# Altium schematic sheet OutputConnectors.SchDoc: Output Connectors
size Letter; Engineer: Brandt Buchda & Patrick Nowakowski; SheetNumber: 3; SheetTotal: 4
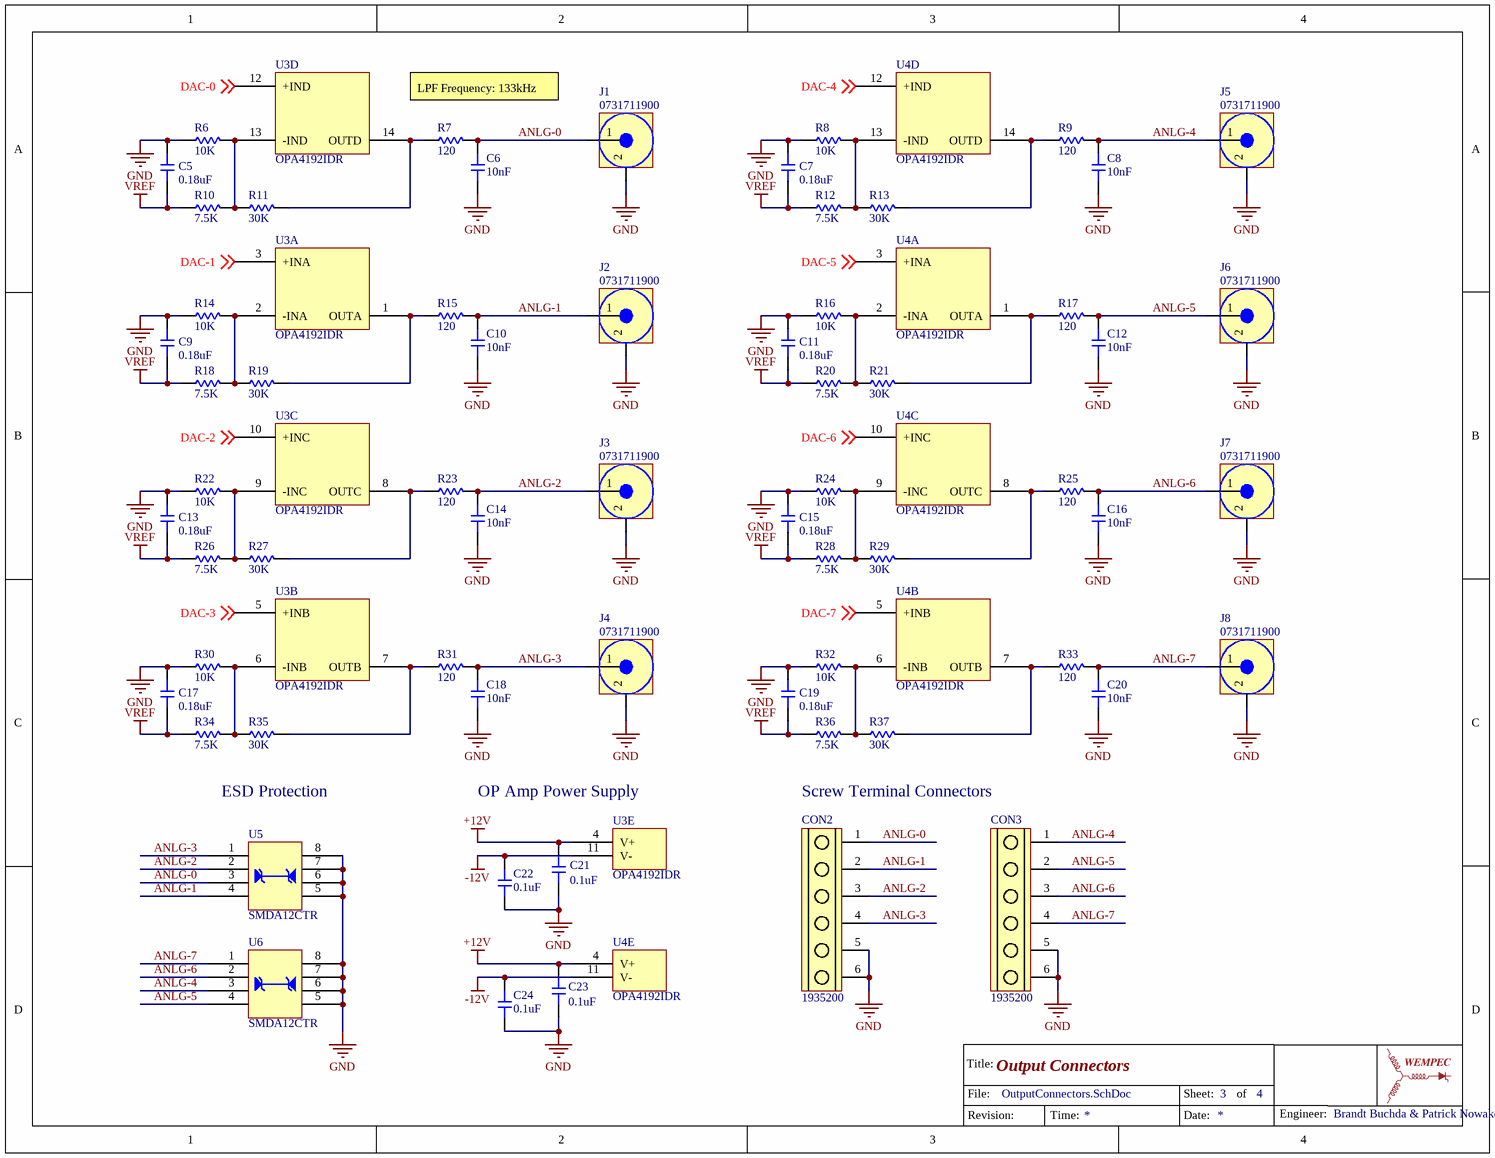
[diagram p0: OutputConnectors.SchDoc]

## Parts
C5  value 0.18uF  [0603-CAP]  (hidden comment: CC0603KRX7R7BB184)
C6  value 10nF  [0603-CAP]  (hidden comment: CC0603KRX7R9BB103)
C7  value 0.18uF  [0603-CAP]  (hidden comment: CC0603KRX7R7BB184)
C8  value 10nF  [0603-CAP]  (hidden comment: CC0603KRX7R9BB103)
C9  value 0.18uF  [0603-CAP]  (hidden comment: CC0603KRX7R7BB184)
C10  value 10nF  [0603-CAP]  (hidden comment: CC0603KRX7R9BB103)
C11  value 0.18uF  [0603-CAP]  (hidden comment: CC0603KRX7R7BB184)
C12  value 10nF  [0603-CAP]  (hidden comment: CC0603KRX7R9BB103)
C13  value 0.18uF  [0603-CAP]  (hidden comment: CC0603KRX7R7BB184)
C14  value 10nF  [0603-CAP]  (hidden comment: CC0603KRX7R9BB103)
C15  value 0.18uF  [0603-CAP]  (hidden comment: CC0603KRX7R7BB184)
C16  value 10nF  [0603-CAP]  (hidden comment: CC0603KRX7R9BB103)
C17  value 0.18uF  [0603-CAP]  (hidden comment: CC0603KRX7R7BB184)
C18  value 10nF  [0603-CAP]  (hidden comment: CC0603KRX7R9BB103)
C19  value 0.18uF  [0603-CAP]  (hidden comment: CC0603KRX7R7BB184)
C20  value 10nF  [0603-CAP]  (hidden comment: CC0603KRX7R9BB103)
C21  value 0.1uF  [0603-CAP]  (hidden comment: CC0603KRX7R8BB104)
C22  value 0.1uF  [0603-CAP]  (hidden comment: CC0603KRX7R8BB104)
C23  value 0.1uF  [0603-CAP]  (hidden comment: CC0603KRX7R8BB104)
C24  value 0.1uF  [0603-CAP]  (hidden comment: CC0603KRX7R8BB104)
CON2  1935200  [1935200]
CON3  1935200  [1935200]
J1  0731711900  [0731711900]
J2  0731711900  [0731711900]
J3  0731711900  [0731711900]
J4  0731711900  [0731711900]
J5  0731711900  [0731711900]
J6  0731711900  [0731711900]
J7  0731711900  [0731711900]
J8  0731711900  [0731711900]
R6  value 10K  [0603-RES]  (hidden comment: ERJ-PB3B1002V)
R7  value 120  [0603-RES]  (hidden comment: RC0603FR-07120RL)
R8  value 10K  [0603-RES]  (hidden comment: ERJ-PB3B1002V)
R9  value 120  [0603-RES]  (hidden comment: RC0603FR-07120RL)
R10  value 7.5K  [0603-RES]  (hidden comment: ERJ-PB3B7501V)
R11  value 30K  [0603-RES]  (hidden comment: ERJ-PB3B3002V)
R12  value 7.5K  [0603-RES]  (hidden comment: ERJ-PB3B7501V)
R13  value 30K  [0603-RES]  (hidden comment: ERJ-PB3B3002V)
R14  value 10K  [0603-RES]  (hidden comment: ERJ-PB3B1002V)
R15  value 120  [0603-RES]  (hidden comment: RC0603FR-07120RL)
R16  value 10K  [0603-RES]  (hidden comment: ERJ-PB3B1002V)
R17  value 120  [0603-RES]  (hidden comment: RC0603FR-07120RL)
R18  value 7.5K  [0603-RES]  (hidden comment: ERJ-PB3B7501V)
R19  value 30K  [0603-RES]  (hidden comment: ERJ-PB3B3002V)
R20  value 7.5K  [0603-RES]  (hidden comment: ERJ-PB3B7501V)
R21  value 30K  [0603-RES]  (hidden comment: ERJ-PB3B3002V)
R22  value 10K  [0603-RES]  (hidden comment: ERJ-PB3B1002V)
R23  value 120  [0603-RES]  (hidden comment: RC0603FR-07120RL)
R24  value 10K  [0603-RES]  (hidden comment: ERJ-PB3B1002V)
R25  value 120  [0603-RES]  (hidden comment: RC0603FR-07120RL)
R26  value 7.5K  [0603-RES]  (hidden comment: ERJ-PB3B7501V)
R27  value 30K  [0603-RES]  (hidden comment: ERJ-PB3B3002V)
R28  value 7.5K  [0603-RES]  (hidden comment: ERJ-PB3B7501V)
R29  value 30K  [0603-RES]  (hidden comment: ERJ-PB3B3002V)
R30  value 10K  [0603-RES]  (hidden comment: ERJ-PB3B1002V)
R31  value 120  [0603-RES]  (hidden comment: RC0603FR-07120RL)
R32  value 10K  [0603-RES]  (hidden comment: ERJ-PB3B1002V)
R33  value 120  [0603-RES]  (hidden comment: RC0603FR-07120RL)
R34  value 7.5K  [0603-RES]  (hidden comment: ERJ-PB3B7501V)
R35  value 30K  [0603-RES]  (hidden comment: ERJ-PB3B3002V)
R36  value 7.5K  [0603-RES]  (hidden comment: ERJ-PB3B7501V)
R37  value 30K  [0603-RES]  (hidden comment: ERJ-PB3B3002V)
U3  OPA4192IDR  [SOIC127P600X175-14N]  (parts A,B,C,D,E of 5)
U4  OPA4192IDR  [SOIC127P600X175-14N]  (parts A,B,C,D,E of 5)
U5  SMDA12CTR  [SOIC127P600X175-8N-B]
U6  SMDA12CTR  [SOIC127P600X175-8N-B]

## Nets
+12V: C21.2 C23.2 U3.4(V+) U4.4(V+)
-12V: C22.2 C24.2 U3.11(V-) U4.11(V-)
GND: C5.2 C6.1 C7.2 C8.1 C9.2 C10.1 C11.2 C12.1 C13.2 C14.1 C15.2 C16.1 C17.2 C18.1 C19.2 C20.1 C21.1 C22.1 C23.1 C24.1 CON2.5 CON2.6 CON3.5 CON3.6 J1.2(GND) J2.2(GND) J3.2(GND) J4.2(GND) J5.2(GND) J6.2(GND) J7.2(GND) J8.2(GND) R6.1 R8.1 R14.1 R16.1 R22.1 R24.1 R30.1 R32.1 U5.5 U5.6 U5.7 U5.8 U6.5 U6.6 U6.7 U6.8
VREF: C5.1 C7.1 C9.1 C11.1 C13.1 C15.1 C17.1 C19.1 R10.1 R12.1 R18.1 R20.1 R26.1 R28.1 R34.1 R36.1
ANLG-0: C6.2 CON2.1 J1.1(ANLG) R7.2 U5.3
ANLG-1: C10.2 CON2.2 J2.1(ANLG) R15.2 U5.4
ANLG-2: C14.2 CON2.3 J3.1(ANLG) R23.2 U5.2
ANLG-3: C18.2 CON2.4 J4.1(ANLG) R31.2 U5.1
ANLG-4: C8.2 CON3.1 J5.1(ANLG) R9.2 U6.3
ANLG-5: C12.2 CON3.2 J6.1(ANLG) R17.2 U6.4
ANLG-6: C16.2 CON3.3 J7.1(ANLG) R25.2 U6.2
ANLG-7: C20.2 CON3.4 J8.1(ANLG) R33.2 U6.1
DAC-0: U3.12(+IND) ; off-sheet DAC-0
DAC-1: U3.3(+INA) ; off-sheet DAC-1
DAC-2: U3.10(+INC) ; off-sheet DAC-2
DAC-3: U3.5(+INB) ; off-sheet DAC-3
DAC-4: U4.12(+IND) ; off-sheet DAC-4
DAC-5: U4.3(+INA) ; off-sheet DAC-5
DAC-6: U4.10(+INC) ; off-sheet DAC-6
DAC-7: U4.5(+INB) ; off-sheet DAC-7
NetR6_2: R6.2 R10.2 R11.1 U3.13(-IND)
NetR7_1: R7.1 R11.2 U3.14(OUTD)
NetR8_2: R8.2 R12.2 R13.1 U4.13(-IND)
NetR9_1: R9.1 R13.2 U4.14(OUTD)
NetR14_2: R14.2 R18.2 R19.1 U3.2(-INA)
NetR15_1: R15.1 R19.2 U3.1(OUTA)
NetR16_2: R16.2 R20.2 R21.1 U4.2(-INA)
NetR17_1: R17.1 R21.2 U4.1(OUTA)
NetR22_2: R22.2 R26.2 R27.1 U3.9(-INC)
NetR23_1: R23.1 R27.2 U3.8(OUTC)
NetR24_2: R24.2 R28.2 R29.1 U4.9(-INC)
NetR25_1: R25.1 R29.2 U4.8(OUTC)
NetR30_2: R30.2 R34.2 R35.1 U3.6(-INB)
NetR31_1: R31.1 R35.2 U3.7(OUTB)
NetR32_2: R32.2 R36.2 R37.1 U4.6(-INB)
NetR33_1: R33.1 R37.2 U4.7(OUTB)

## Notes on the sheet
- LPF Frequency: 133kHz
- ESD Protection
- OP Amp Power Supply
- Screw Terminal Connectors
- Title:
- File:
- Sheet:
- of
- Revision:
- Time:
- Date:
- Engineer:

## Library data of the parts
C5 C7 C9 C11 C13 C15 C17 C19 = Capacitor 0.18uF: 0.18µF ±10% 16V Ceramic Capacitor X7R 0603 (1608 Metric); Supplier 1: Digi-Key; Supplier Part Number 1: 311-4066-1-ND
C6 C8 C10 C12 C14 C16 C18 C20 = Capacitor 10nF: 10000pF ±10% 50V Ceramic Capacitor X7R 0603 (1608 Metric); Supplier 1: Digi-Key; Supplier Part Number 1: 311-1085-1-ND
C21-C24 = Capacitor 0.1uF: 0.1µF ±10% 25V Ceramic Capacitor X7R 0603 (1608 Metric); Supplier 1: Digi-Key; Supplier Part Number 1: 311-1341-1-ND
CON2 CON3 = 1935200: 6 Position Wire to Board Terminal Block Horizontal with Board 0.197" (5.00mm) Through Hole; Supplier 1: Digi-Key; Supplier Part Number 1: 277-1581-ND
J1-J8 = 0731711900: CONN BNC JACK STR 75 OHM PCB; Supplier 1: Digi-Key; Supplier Part Number 1: WM5517-ND
R6 R8 R14 R16 R22 R24 R30 R32 = Resistor 10K: 10 kOhms ±0.1% 0.2W, 1/5W Chip Resistor 0603 (1608 Metric) Automotive AEC-Q200, Pulse Withstanding Thick Film; Supplier 1: Digi-Key; Supplier Part Number 1: P20086CT-ND
R7 R9 R15 R17 R23 R25 R31 R33 = Resistor 120: 120 Ohms ±1% 0.1W, 1/10W Chip Resistor 0603 (1608 Metric) Moisture Resistant Thick Film; Supplier 1: Digi-Key; Supplier Part Number 1: 311-120HRCT-ND
R10 R12 R18 R20 R26 R28 R34 R36 = Resistor 7.5K: 7.5 kOhms ±0.1% 0.2W, 1/5W Chip Resistor 0603 (1608 Metric) Automotive AEC-Q200, Pulse Withstanding Thick Film; Supplier 1: Digi-Key; Supplier Part Number 1: P20072CT-ND
R11 R13 R19 R21 R27 R29 R35 R37 = Resistor 30K: 30 kOhms ±0.1% 0.2W, 1/5W Chip Resistor 0603 (1608 Metric) Automotive AEC-Q200, Pulse Withstanding Thick Film; Supplier 1: Digi-Key; Supplier Part Number 1: P20138CT-ND
U3 U4 = OPA4192IDR: General Purpose Amplifier 4 Circuit Rail-to-Rail 14-SOIC; Supplier 1: Digi-Key; Supplier Part Number 1: 296-43159-1-ND
U5 U6 = SMDA12CTR: 19V Clamp 1A (8/20µs) Ipp TVS Diode Surface Mount 8-SO. No common node.; Supplier 1: Digi-Key; Supplier Part Number 1: 1655-1701-1-ND